# EAGLE schematic main_board-v1 (EAGLE 6.4)
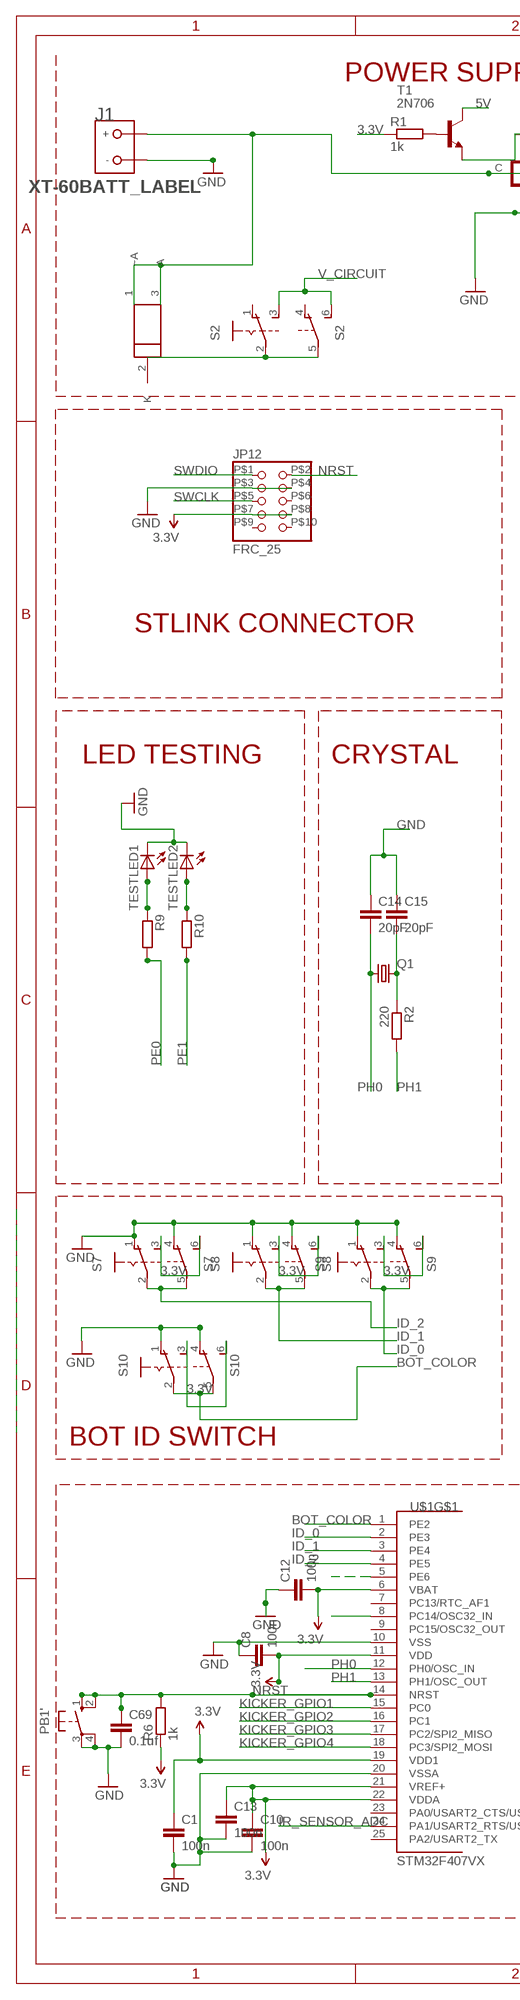
[diagram p0: schematic, sheet 1, part 1 of 2]
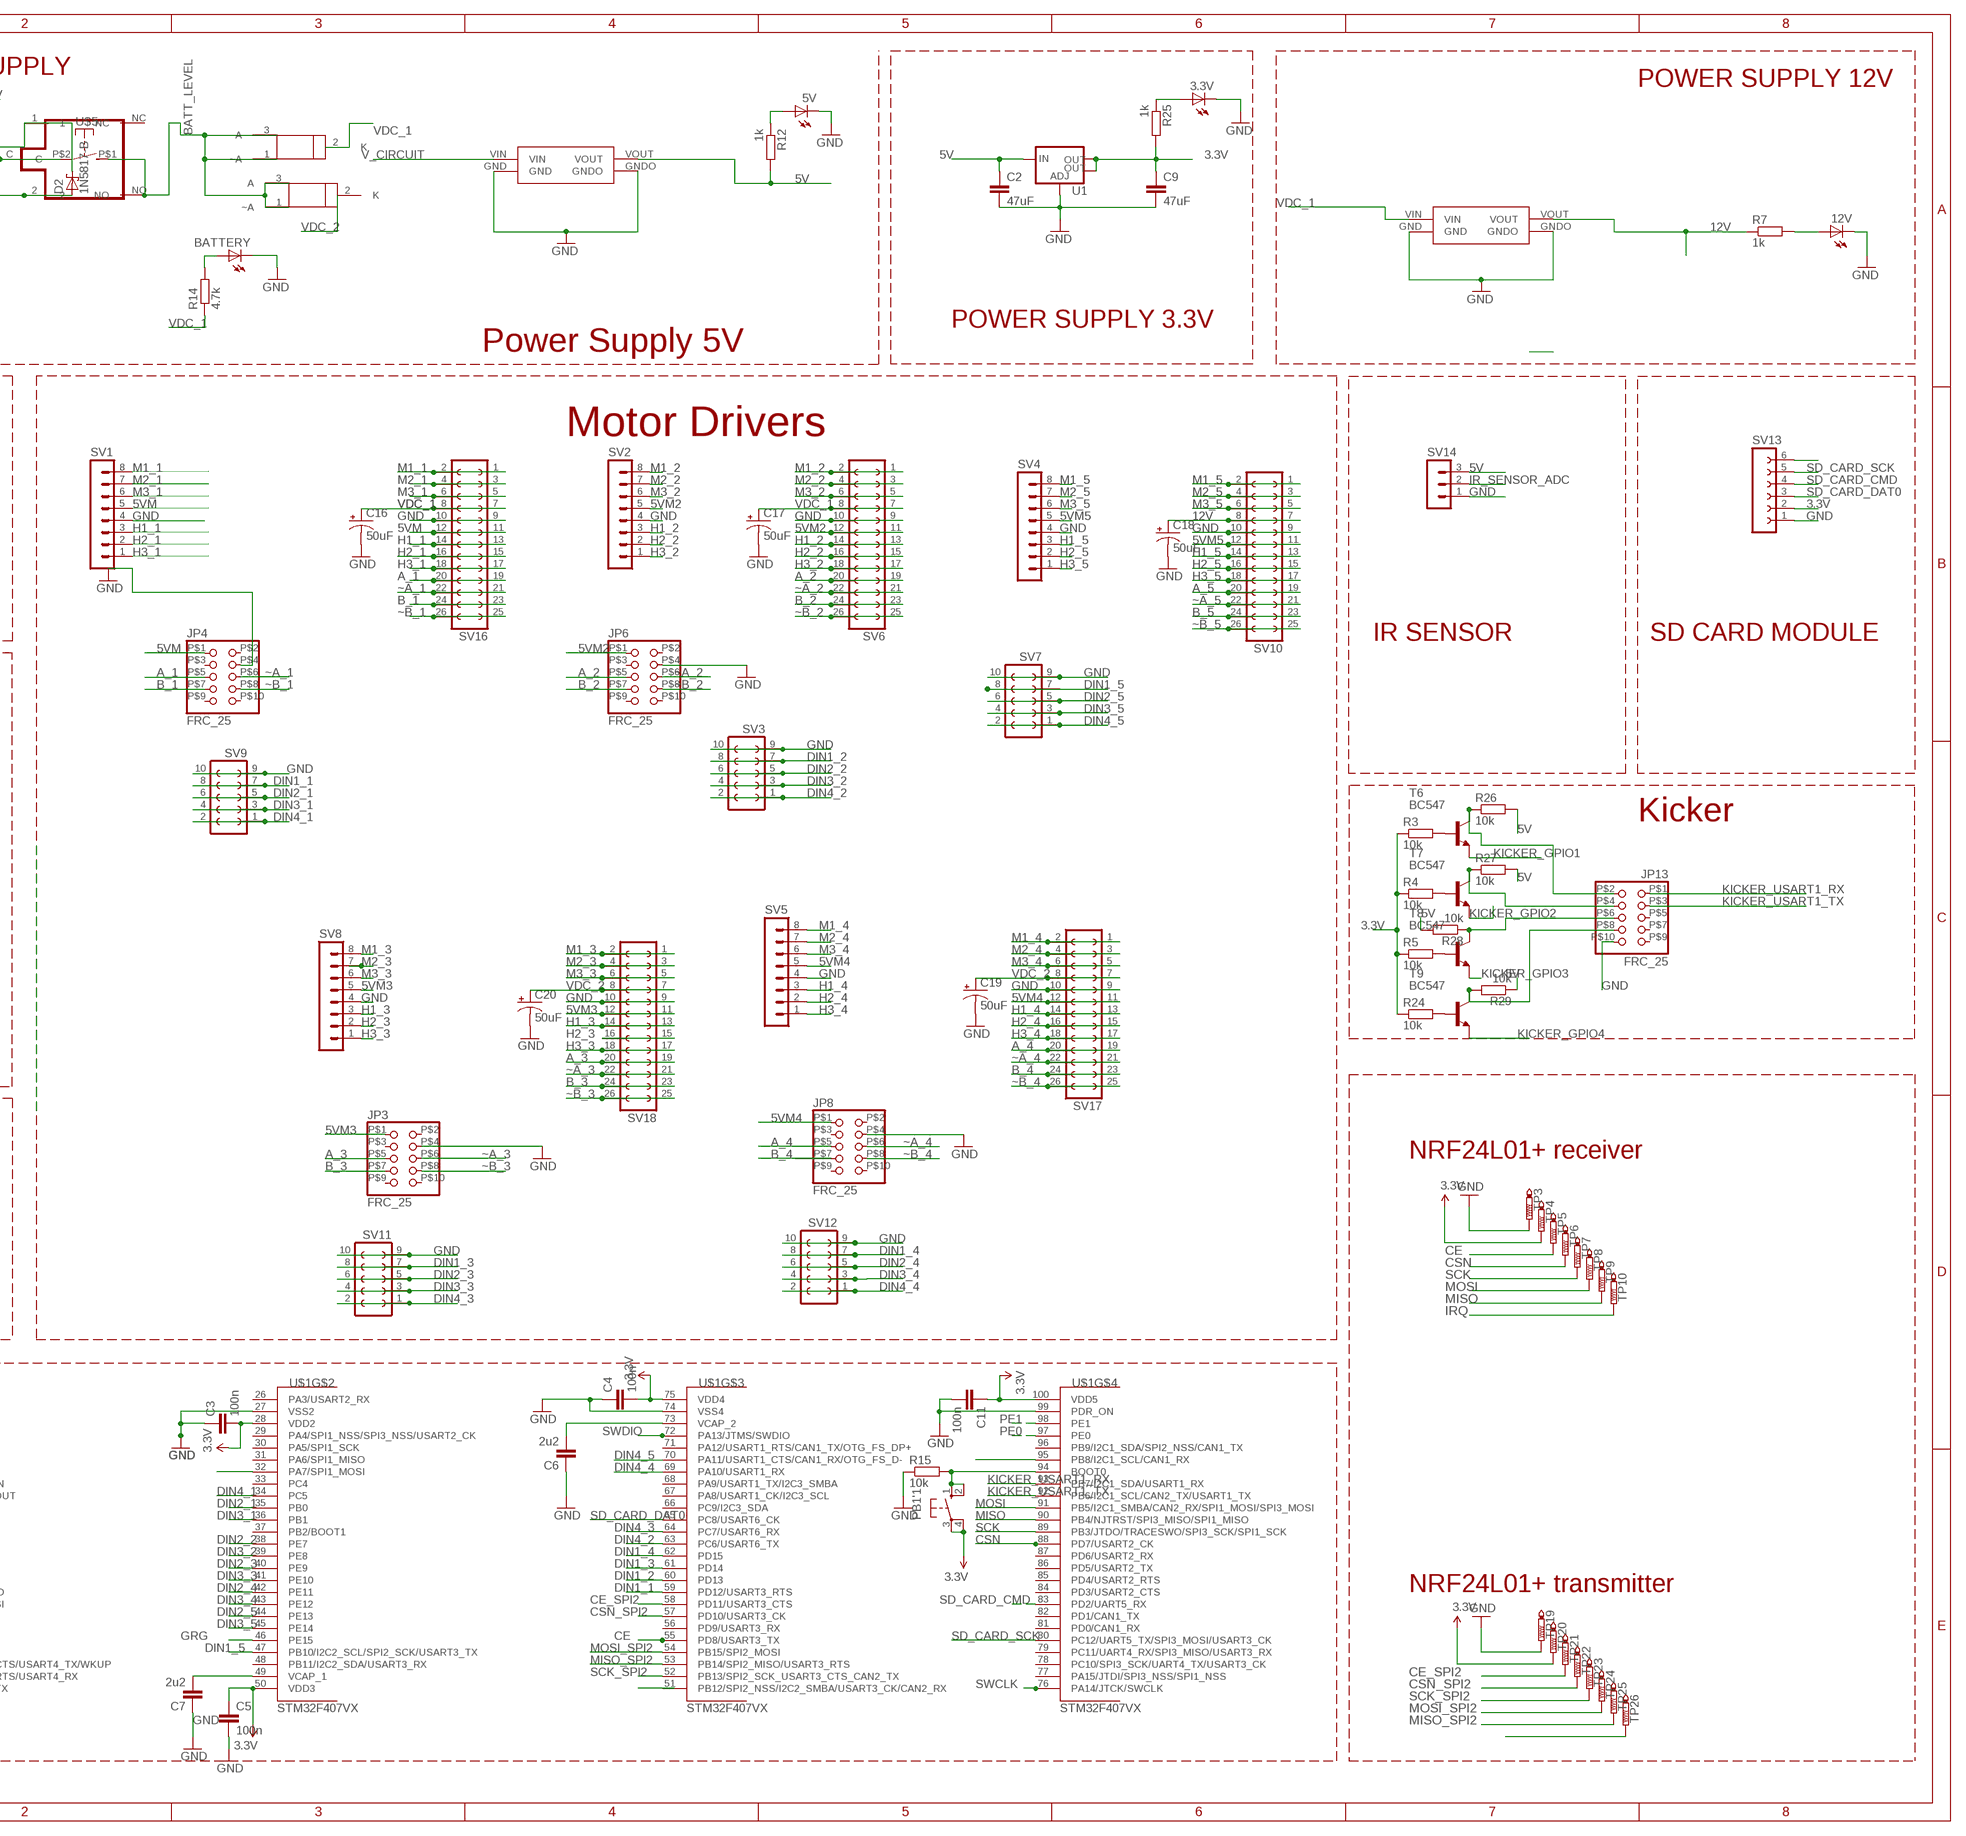
[diagram p1: schematic, sheet 1, part 2 of 2]

## Parts
3.3V  LEDCHIPLED_1206  [CHIPLED_1206]
5V  LEDCHIPLED_1206  [CHIPLED_1206]
12V  LEDCHIPLED_1206  [CHIPLED_1206]
BATTERY  LEDCHIPLED_1206  [CHIPLED_1206]
C1  100n  C-EUC1206  [C1206]
C2  47uF  C-EUC1206  [C1206]
C3  100n  C-EUC1206  [C1206]
C4  100n  C-EUC1206  [C1206]
C5  100n  C-EUC1206  [C1206]
C6  2u2  C-EUC1206  [C1206]
C7  2u2  C-EUC1206  [C1206]
C8  100n  C-EUC1206  [C1206]
C9  47uF  C-EUC1206  [C1206]
C10  100n  C-EUC1206  [C1206]
C11  100n  C-EUC1206  [C1206]
C12  100n  C-EUC1206  [C1206]
C13  100n  C-EUC1206  [C1206]
C14  20pF  C-EUC1206  [C1206]
C15  20pF  C-EUC1206  [C1206]
C16  50uF  CPOL-USE3.5-8  [E3,5-8]
C17  50uF  CPOL-USE3.5-8  [E3,5-8]
C18  50uF  CPOL-USE3.5-8  [E3,5-8]
C19  50uF  CPOL-USE3.5-8  [E3,5-8]
C20  50uF  CPOL-USE3.5-8  [E3,5-8]
C69  0.1uf  C-EUC1206  [C1206]
D2  1N5817-B  [DO41-7.6]
J1  XT-60BATT_LABEL  [XT-60]
JP3  FRC_25  [FRC2*5]
JP4  FRC_25  [FRC2*5]
JP6  FRC_25  [FRC2*5]
JP8  FRC_25  [FRC2*5]
JP12  FRC_25  [FRC2*5]
JP13  FRC_25  [FRC2*5]
PB1'  10-XX  [B3F-10XX]
PB1'1  10-XX  [B3F-10XX]
Q1  CRYSTALHC49U-V  [HC49U-V]
R1  1k  R-EU_R1206  [R1206]
R2  220  R-EU_R1206  [R1206]
R3  10k  R-EU_R1206  [R1206]
R4  10k  R-EU_R1206  [R1206]
R5  10k  R-EU_R1206  [R1206]
R6  1k  R-EU_R1206  [R1206]
R7  1k  R-EU_R1206  [R1206]
R9  R-EU_R1206  [R1206]
R10  R-EU_R1206  [R1206]
R12  1k  R-EU_R1206  [R1206]
R14  4.7k  R-EU_R1206  [R1206]
R15  10k  R-EU_R1206  [R1206]
R24  10k  R-EU_R1206  [R1206]
R25  1k  R-EU_R1206  [R1206]
R26  10k  R-EU_R1206  [R1206]
R27  10k  R-EU_R1206  [R1206]
R28  10k  R-EU_R1206  [R1206]
R29  10k  R-EU_R1206  [R1206]
S2  A68-A31  [A68-A31]
S7  A68-A31  [A68-A31]
S8  A68-A31  [A68-A31]
S9  A68-A31  [A68-A31]
S10  A68-A31  [A68-A31]
SV1  MA08-1  [MA08-1]
SV2  MA08-1  [MA08-1]
SV3  FE05-2  [FE05-2]
SV4  MA08-1  [MA08-1]
SV5  MA08-1  [MA08-1]
SV6  FE13-2  [FE13-2]
SV7  FE05-2  [FE05-2]
SV8  MA08-1  [MA08-1]
SV9  FE05-2  [FE05-2]
SV10  FE13-2  [FE13-2]
SV11  FE05-2  [FE05-2]
SV12  FE05-2  [FE05-2]
SV13  FE06-1  [FE06]
SV14  MA03-1  [MA03-1]
SV16  FE13-2  [FE13-2]
SV17  FE13-2  [FE13-2]
SV18  FE13-2  [FE13-2]
T1  2N706  [TO18]
T6  BC547  [TO92]
T7  BC547  [TO92]
T8  BC547  [TO92]
T9  BC547  [TO92]
TESTLED1  LEDCHIPLED_1206  [CHIPLED_1206]
TESTLED2  LEDCHIPLED_1206  [CHIPLED_1206]
TP3  PTR1PAD1-13  [P1-13]
TP4  PTR1PAD1-13  [P1-13]
TP5  PTR1PAD1-13  [P1-13]
TP6  PTR1PAD1-13  [P1-13]
TP7  PTR1PAD1-13  [P1-13]
TP8  PTR1PAD1-13  [P1-13]
TP9  PTR1PAD1-13  [P1-13]
TP10  PTR1PAD1-13  [P1-13]
TP19  PTR1PAD1-13  [P1-13]
TP20  PTR1PAD1-13  [P1-13]
TP21  PTR1PAD1-13  [P1-13]
TP22  PTR1PAD1-13  [P1-13]
TP23  PTR1PAD1-13  [P1-13]
TP24  PTR1PAD1-13  [P1-13]
TP25  PTR1PAD1-13  [P1-13]
TP26  PTR1PAD1-13  [P1-13]
U1  V_REG_LM1117SOT223  [SOT223]
U2  LP38690DT-3.3  [TO228P1042X238-3N]
U3  LP38690DT-3.3  [TO228P1042X238-3N]
U4  LP38690DT-3.3  [TO228P1042X238-3N]
U$1  STM32F407VX  [LQFP100]
U$2  REL  [REL]
U$3  BUCK  [BUCK]
U$4  BUCK  [BUCK]
U$5  SWITCH_DA10  [DA10]

## Nets
3.3V: C1.1 C3.2 C4.2 C5.1 C8.2 C9.1 C10.1 C11.1 C12.2 C13.1 JP12.P$7 JP12.P$8 PB1'1.3(P) PB1'1.4(P1) R3.1 R4.1 R5.1 R6.1 R24.1 R25.2 S7.3(A:S) S7.6(B:S) S8.3(A:S) S8.6(B:S) S9.3(A:S) S9.6(B:S) S10.3(A:S) S10.6(B:S) SV13.2 TP4.TP TP20.TP U1.2(OUT) U1.4(OUT) U$1.6(VBAT) U$1.11(VDD) U$1.19(VDD1) U$1.21(VREF+) U$1.22(VDDA) U$1.28(VDD2) U$1.50(VDD3) U$1.75(VDD4) U$1.100(VDD5)
5V: C2.1 R12.2 R26.2 R27.2 R28.2 R29.1 SV14.3 T1.3(C) U1.3(IN) U$3.VOUT
5VM: JP4.P$1 SV1.5 SV16.11 SV16.12
5VM2: JP6.P$1 SV2.5 SV6.11 SV6.12
5VM3: JP3.P$1 SV8.5 SV18.11 SV18.12
5VM4: JP8.P$1 SV5.5 SV17.11 SV17.12
5VM5: SV4.5 SV10.11 SV10.12
12V: C18.+ R7.1 SV10.7 SV10.8 U$4.VOUT
A_1: JP4.P$5 SV16.19 SV16.20
A_2: JP6.P$5 SV6.19 SV6.20
A_3: JP3.P$5 SV18.19 SV18.20
A_4: JP8.P$5 SV17.19 SV17.20
A_5: SV10.19 SV10.20
B_1: JP4.P$7 SV16.23 SV16.24
B_2: JP6.P$7 SV6.23 SV6.24
B_3: JP3.P$7 SV18.23 SV18.24
B_4: JP8.P$7 SV17.23 SV17.24
B_5: SV10.23 SV10.24
BATT_LEVEL: U2.1(~A) U2.3(A) U4.1(~A) U4.3(A) U$2.NO U$5.P$1(S)
BOT_COLOR: S10.2(A:P) S10.5(B:P) U$1.1(PE2)
CE: TP5.TP U$1.55(PD8/USART3_TX)
CE_SPI2: TP21.TP U$1.58(PD11/USART3_CTS)
CSN: TP6.TP U$1.88(PD7/USART2_CK)
CSN_SPI2: TP22.TP U$1.57(PD10/USART3_CK)
DIN1_1: SV9.7 SV9.8 U$1.59(PD12/USART3_RTS)
DIN1_2: SV3.7 SV3.8 U$1.60(PD13)
DIN1_3: SV11.7 SV11.8 U$1.61(PD14)
DIN1_4: SV12.7 SV12.8 U$1.62(PD15)
DIN1_5: SV7.7 SV7.8 U$1.47(PB10/I2C2_SCL/SPI2_SCK/USART3_TX)
DIN2_1: SV9.5 SV9.6 U$1.35(PB0)
DIN2_2: SV3.5 SV3.6 U$1.38(PE7)
DIN2_3: SV11.5 SV11.6 U$1.40(PE9)
DIN2_4: SV12.5 SV12.6 U$1.42(PE11)
DIN2_5: SV7.5 SV7.6 U$1.44(PE13)
DIN3_1: SV9.3 SV9.4 U$1.36(PB1)
DIN3_2: SV3.3 SV3.4 U$1.39(PE8)
DIN3_3: SV11.3 SV11.4 U$1.41(PE10)
DIN3_4: SV12.3 SV12.4 U$1.43(PE12)
DIN3_5: SV7.3 SV7.4 U$1.45(PE14)
DIN4_1: SV9.1 SV9.2 U$1.34(PC5)
DIN4_2: SV3.1 SV3.2 U$1.63(PC6/USART6_TX)
DIN4_3: SV11.1 SV11.2 U$1.64(PC7/USART6_RX)
DIN4_4: SV12.1 SV12.2 U$1.69(PA10/USART1_RX)
DIN4_5: SV7.1 SV7.2 U$1.70(PA11/USART1_CTS/CAN1_RX/OTG_FS_D-)
GND: 3.3V.C 5V.C 12V.C BATTERY.C C1.2 C2.2 C3.1 C4.1 C5.2 C6.1 C7.1 C8.1 C9.2 C10.2 C11.2 C12.1 C13.2 C14.1 C15.1 C16.- C17.- C18.- C19.- C20.- C69.2 D2.A J1.GND(-) JP3.P$4 JP4.P$4 JP6.P$4 JP8.P$4 JP12.P$3 JP12.P$4 JP13.P$10 PB1'.3(P) PB1'.4(P1) R15.1 S7.1(A:O) S7.4(B:O) S8.1(A:O) S8.4(B:O) S9.1(A:O) S9.4(B:O) S10.1(A:O) S10.4(B:O) SV1.4 SV2.4 SV3.9 SV3.10 SV4.4 SV5.4 SV6.9 SV6.10 SV7.9 SV7.10 SV8.4 SV9.9 SV9.10 SV10.9 SV10.10 SV11.9 SV11.10 SV12.9 SV12.10 SV13.1 SV14.1 SV16.9 SV16.10 SV17.9 SV17.10 SV18.9 SV18.10 TESTLED1.C TESTLED2.C TP3.TP TP19.TP U1.1(ADJ) U$1.10(VSS) U$1.20(VSSA) U$1.27(VSS2) U$1.74(VSS4) U$1.99(PDR_ON) U$2.2 U$3.GND U$3.GNDO U$4.GND U$4.GNDO
GRG: U$1.46(PE15)
H1_1: SV1.3 SV16.13 SV16.14
H1_2: SV2.3 SV6.13 SV6.14
H1_3: SV8.3 SV18.13 SV18.14
H1_4: SV5.3 SV17.13 SV17.14
H1_5: SV4.3 SV10.13 SV10.14
H2_1: SV1.2 SV16.15 SV16.16
H2_2: SV2.2 SV6.15 SV6.16
H2_3: SV8.2 SV18.15 SV18.16
H2_4: SV5.2 SV17.15 SV17.16
H2_5: SV4.2 SV10.15 SV10.16
H3_1: SV1.1 SV16.17 SV16.18
H3_2: SV2.1 SV6.17 SV6.18
H3_3: SV8.1 SV18.17 SV18.18
H3_4: SV5.1 SV17.17 SV17.18
H3_5: SV4.1 SV10.17 SV10.18
ID_0: S9.2(A:P) S9.5(B:P) U$1.2(PE3)
ID_1: S8.2(A:P) S8.5(B:P) U$1.3(PE4)
ID_2: S7.2(A:P) S7.5(B:P) U$1.4(PE5)
IR_SENSOR_ADC: SV14.2 U$1.24(PA1/USART2_RTS/USART4_RX)
IRQ: TP10.TP
IRQ_SPI2: U$1.8(PC14/OSC32_IN)
KICKER_GPIO1: T6.1(E) U$1.15(PC0)
KICKER_GPIO2: T7.1(E) U$1.16(PC1)
KICKER_GPIO3: T8.1(E) U$1.17(PC2/SPI2_MISO)
KICKER_GPIO4: T9.1(E) U$1.18(PC3/SPI2_MOSI)
KICKER_USART1_RX: JP13.P$1 U$1.93(PB7/I2C1_SDA/USART1_RX)
KICKER_USART1_TX: JP13.P$3 U$1.92(PB6/I2C1_SCL/CAN2_TX/USART1_TX)
M1_1: SV1.8 SV16.1 SV16.2
M1_2: SV2.8 SV6.1 SV6.2
M1_3: SV8.8 SV18.1 SV18.2
M1_4: SV5.8 SV17.1 SV17.2
M1_5: SV4.8 SV10.1 SV10.2
M2_1: SV1.7 SV16.3 SV16.4
M2_2: SV2.7 SV6.3 SV6.4
M2_3: SV8.7 SV18.3 SV18.4
M2_4: SV5.7 SV17.3 SV17.4
M2_5: SV4.7 SV10.3 SV10.4
M3_1: SV1.6 SV16.5 SV16.6
M3_2: SV2.6 SV6.5 SV6.6
M3_3: SV8.6 SV18.5 SV18.6
M3_4: SV5.6 SV17.5 SV17.6
M3_5: SV4.6 SV10.5 SV10.6
MISO: TP9.TP U$1.90(PB4/NJTRST/SPI3_MISO/SPI1_MISO)
MISO_SPI2: TP25.TP U$1.53(PB14/SPI2_MISO/USART3_RTS)
MOSI: TP8.TP U$1.91(PB5/I2C1_SMBA/CAN2_RX/SPI1_MOSI/SPI3_MOSI)
MOSI_SPI2: TP24.TP U$1.54(PB15/SPI2_MOSI)
N$2: R10.1 TESTLED2.A
N$3: C7.2 U$1.49(VCAP_1)
N$4: C6.2 U$1.73(VCAP_2)
N$6: PB1'1.1(S) PB1'1.2(S1) R15.2 U$1.94(BOOT0)
N$7: U$1.5(PE6)
N$8: U$1.32(PA7/SPI1_MOSI)
N$9: R9.1 TESTLED1.A
N$10: C15.2 Q1.2 R2.1
N$12: 5V.A R12.1
N$13: J1.BATT(+) U3.1(~A) U3.3(A) U$2.C U$5.P$2(P)
N$14: 12V.A R7.2
N$15: SV13.6
N$18: BATTERY.A R14.2
N$19: 3.3V.A R25.1
N$20: U$1.95(PB8/I2C1_SCL/CAN1_RX)
N$21: R1.2 T1.2(B)
N$22: D2.C T1.1(E) U$2.1
N$24: TP26.TP
N$25: S2.2(A:P) S2.5(B:P) U3.2(K)
N$35: R5.2 T8.2(B)
N$37: R3.2 T6.2(B)
N$38: R4.2 T7.2(B)
N$39: R24.2 T9.2(B)
N$40: JP13.P$2 R26.1 T6.3(C)
N$41: JP13.P$4 R27.1 T7.3(C)
N$42: JP13.P$6 R28.1 T8.3(C)
N$43: JP13.P$8 R29.2 T9.3(C)
NRST: C69.1 JP12.P$2 PB1'.1(S) PB1'.2(S1) R6.2 U$1.14(NRST)
PE0: R9.2 U$1.97(PE0)
PE1: R10.2 U$1.98(PE1)
PH0: C14.2 Q1.1 U$1.12(PH0/OSC_IN)
PH1: R2.2 U$1.13(PH1/OSC_OUT)
SCK: TP7.TP U$1.89(PB3/JTDO/TRACESWO/SPI3_SCK/SPI1_SCK)
SCK_SPI2: TP23.TP U$1.52(PB13/SPI2_SCK_USART3_CTS_CAN2_TX)
SD_CARD_CMD: SV13.4 U$1.83(PD2/UART5_RX)
SD_CARD_DAT0: SV13.3 U$1.65(PC8/USART6_CK)
SD_CARD_SCK: SV13.5 U$1.80(PC12/UART5_TX/SPI3_MOSI/USART3_CK)
SWCLK: JP12.P$5 U$1.76(PA14/JTCK/SWCLK)
SWDIO: JP12.P$1 U$1.72(PA13/JTMS/SWDIO)
V_CIRCUIT: S2.3(A:S) S2.6(B:S) U$3.VIN
VDC_1: C16.+ C17.+ R14.1 SV6.7 SV6.8 SV16.7 SV16.8 U4.2(K) U$4.VIN
VDC_2: C19.+ C20.+ SV17.7 SV17.8 SV18.7 SV18.8 U2.2(K)
~A_1: JP4.P$6 SV16.21 SV16.22
~A_2: JP6.P$6 SV6.21 SV6.22
~A_3: JP3.P$6 SV18.21 SV18.22
~A_4: JP8.P$6 SV17.21 SV17.22
~A_5: SV10.21 SV10.22
~B_1: JP4.P$8 SV16.25 SV16.26
~B_2: JP6.P$8 SV6.25 SV6.26
~B_3: JP3.P$8 SV18.25 SV18.26
~B_4: JP8.P$8 SV17.25 SV17.26
~B_5: SV10.25 SV10.26
Unconnected: JP3.P$2 JP3.P$3 JP3.P$9 JP3.P$10 JP4.P$2 JP4.P$3 JP4.P$9 JP4.P$10 JP6.P$2 JP6.P$3 JP6.P$9 JP6.P$10 JP8.P$2 JP8.P$3 JP8.P$9 JP8.P$10 JP12.P$6 JP12.P$9 JP12.P$10 JP13.P$5 JP13.P$7 JP13.P$9 R1.1 S2.1(A:O) S2.4(B:O) U$1.7(PC13/RTC_AF1) U$1.9(PC15/OSC32_OUT) U$1.23(PA0/USART2_CTS/USART4_TX/WKUP) U$1.25(PA2/USART2_TX) U$1.26(PA3/USART2_RX) U$1.29(PA4/SPI1_NSS/SPI3_NSS/USART2_CK) U$1.30(PA5/SPI1_SCK) U$1.31(PA6/SPI1_MISO) U$1.33(PC4) U$1.37(PB2/BOOT1) U$1.48(PB11/I2C2_SDA/USART3_RX) U$1.51(PB12/SPI2_NSS/I2C2_SMBA/USART3_CK/CAN2_RX) U$1.56(PD9/USART3_RX) U$1.66(PC9/I2C3_SDA) U$1.67(PA8/USART1_CK/I2C3_SCL) U$1.68(PA9/USART1_TX/I2C3_SMBA) U$1.71(PA12/USART1_RTS/CAN1_TX/OTG_FS_DP+) U$1.77(PA15/JTDI/SPI3_NSS/SPI1_NSS) U$1.78(PC10/SPI3_SCK/UART4_TX/USART3_CK) U$1.79(PC11/UART4_RX/SPI3_MISO/USART3_RX) U$1.81(PD0/CAN1_RX) U$1.82(PD1/CAN1_TX) U$1.84(PD3/USART2_CTS) U$1.85(PD4/USART2_RTS) U$1.86(PD5/USART2_TX) U$1.87(PD6/USART2_RX) U$1.96(PB9/I2C1_SDA/SPI2_NSS/CAN1_TX) U$2.NC

## Notes on the sheet
- POWER SUPPLY
- POWER SUPPLY 12V
- POWER SUPPLY 3.3V
- Power Supply 5V
- Motor Drivers
- STLINK CONNECTOR
- IR SENSOR | SD CARD MODULE
- LED TESTING | CRYSTAL
- Kicker
- NRF24L01+ receiver
- BOT ID SWITCH
- NRF24L01+ transmitter

## Library data of the parts
3.3V 5V 12V BATTERY TESTLED1 TESTLED2 = led:LED: LED OSRAM: - CHIPLED LG R971, LG N971, LY N971, LG Q971, LY Q971, LO R971, LY R971 LH N974, LH R974 LS Q976, LO Q976, LY Q976 LO Q996 - Hyper CHIPLED LW Q18S LB Q993, LB Q99A, LB R99A - SideLED LS A670, LO A670, LY A670, LG A670, LP A670 LB A673, LV A673, LT A673, LW A673 LH A674 LY A675 LS A676, LA A676, LO A676, LY A676, LW A676 LS A679, LY A679, LG A679 - Hyper Micro SIDELED® LS Y876, LA Y876, LO Y876, LY Y876 LT Y87S - SmartLED LW L88C, LW L88S LB L89C, LB L89S, LG L890 LS L89K, LO L89K, LY L89K LS L896, LA L896, LO L896, LY L896 - TOPLED LS T670, LO T670, LY T670, LG T670, LP T670 LSG T670, LSP T670, LSY T670, LOP T670, LYG T670 LG T671, LOG T671, LSG T671 LB T673, LV T673, LT T673, LW T673 LH T674 LS T676, LA T676, LO T676, LY T676, LB T676, LH T676, LSB T676, LW T676 LB T67C, LV T67C, LT T67C, LS T67K, LO T67K, LY T67K, LW E67C LS E67B, LA E67B, LO E67B, LY E67B, LB E67C, LV E67C, LT E67C LW T67C LS T679, LY T679, LG T679 LS T770, LO T770, LY T770, LG T770, LP T770 LB T773, LV T773, LT T773, LW T773 LH T774 LS E675, LA E675, LY E675, LS T675 LS T776, LA T776, LO T776, LY T776, LB T776 LHGB T686 LT T68C, LB T68C - Hyper Mini TOPLED® LB M676 - Mini TOPLED Santana® LG M470 LS M47K, LO M47K, LY M47K Source: http://www.osram.convergy.de LUXEON: - LUMILED® LXK2-PW12-R00, LXK2-PW12-S00, LXK2-PW14-U00, LXK2-PW14-V00 LXK2-PM12-R00, LXK2-PM12-S00, LXK2-PM14-U00 LXK2-PE12-Q00, LXK2-PE12-R00, LXK2-PE12-S00, LXK2-PE14-T00, LXK2-PE14-U00 LXK2-PB12-K00, LXK2-PB12-L00, LXK2-PB12-M00, LXK2-PB14-N00, LXK2-PB14-P00, LXK2-PB14-Q00 LXK2-PR12-L00, LXK2-PR12-M00, LXK2-PR14-Q00, LXK2-PR14-R00 LXK2-PD12-Q00, LXK2-PD12-R00, LXK2-PD12-S00 LXK2-PH12-R00, LXK2-PH12-S00 LXK2-PL12-P00, LXK2-PL12-Q00, LXK2-PL12-R00 Source: www.luxeon.com KINGBRIGHT: KA-3528ASYC Source: www.kingbright.com
C1-C15 C69 = rcl:C-EU: CAPACITOR, European symbol
C16-C20 = adafruit:CPOL-US: POLARIZED CAPACITOR, American symbol
D2 = diode:1N581*: 1.0A SCHOTTKY BARRIER RECTIFIER Source: http://www.diodes.com/datasheets/ds23001.pdf
J1 = RoboJackets-Connectors:XT-60: XT-60 Power Connector Distributor: HobbyKing <http://www.hobbyking.com/hobbyking/store/RC_PRODUCT_SEARCH.asp?strSearch=xt-60>
JP3 JP4 JP6 JP8 JP12 JP13 = mohit:FRC_2*5
PB1' PB1'1 = switch-omron:10-XX: OMRON SWITCH; MPN: B3F-1000; OC_FARNELL: 176432; OC_NEWARK: 36M3542
Q1 = crystal:CRYSTAL: CRYSTAL; OC_FARNELL: 1666969; OC_NEWARK: unknown
R1-R7 R9 R10 R12 R14 R15 R24-R29 = resistor:R-EU_: RESISTOR, European symbol
S2 S7-S10 = switch:A68-A31: SLIDING SWITCH Siemens, distributor Buerklin, 11G766
SV1 SV2 SV4 SV5 SV8 = con-lstb:MA08-1: PIN HEADER; OC_FARNELL: unknown; OC_NEWARK: unknown
SV3 SV7 SV9 SV11 SV12 = con-lsta:FE05-2: FEMALE HEADER; OC_FARNELL: unknown; OC_NEWARK: unknown
SV6 SV10 SV16-SV18 = con-lsta:FE13-2: FEMALE HEADER; OC_FARNELL: unknown; OC_NEWARK: unknown
SV13 = con-lsta:FE06-1: FEMALE HEADER; OC_FARNELL: unknown; OC_NEWARK: unknown
SV14 = con-lstb:MA03-1: PIN HEADER; OC_FARNELL: unknown; OC_NEWARK: unknown
T1 = transistor:2N706: NPN TRANSISTOR
T6-T9 = transistor:BC547: NPN TRANSISTOR
TP3-TP10 TP19-TP26 = testpad:PTR1: TEST PIN
U1 = SparkFun-PowerIC:V_REG_LM1117: Voltage Regulator LM1117 Standard adjustable voltage regulator but in SMD form. Spark Fun Electronics SKU : COM-00595; PROD_ID: VREG-08170
U2-U4 = LP38690DT-3.3:LP38690DT-3.3; MPN: LP38690DT-3.3; OC_FARNELL: 1008048; OC_NEWARK: 41K7439; PACKAGE: TO-252; SUPPLIER: National Semiconductor
U$1 = STM32F407Vx_LQFP100:STM32F407VX: STmicroelectronics Cortex M4 Series Typ: STM32F407Vx LQFP100 Copyright 2012 by Ersan Günes, Quantitec, info@quantitec.de
U$2 = rel:REL
U$3 U$4 = BUCK:BUCK
U$5 = switch_DA10:SWITCH_DA10